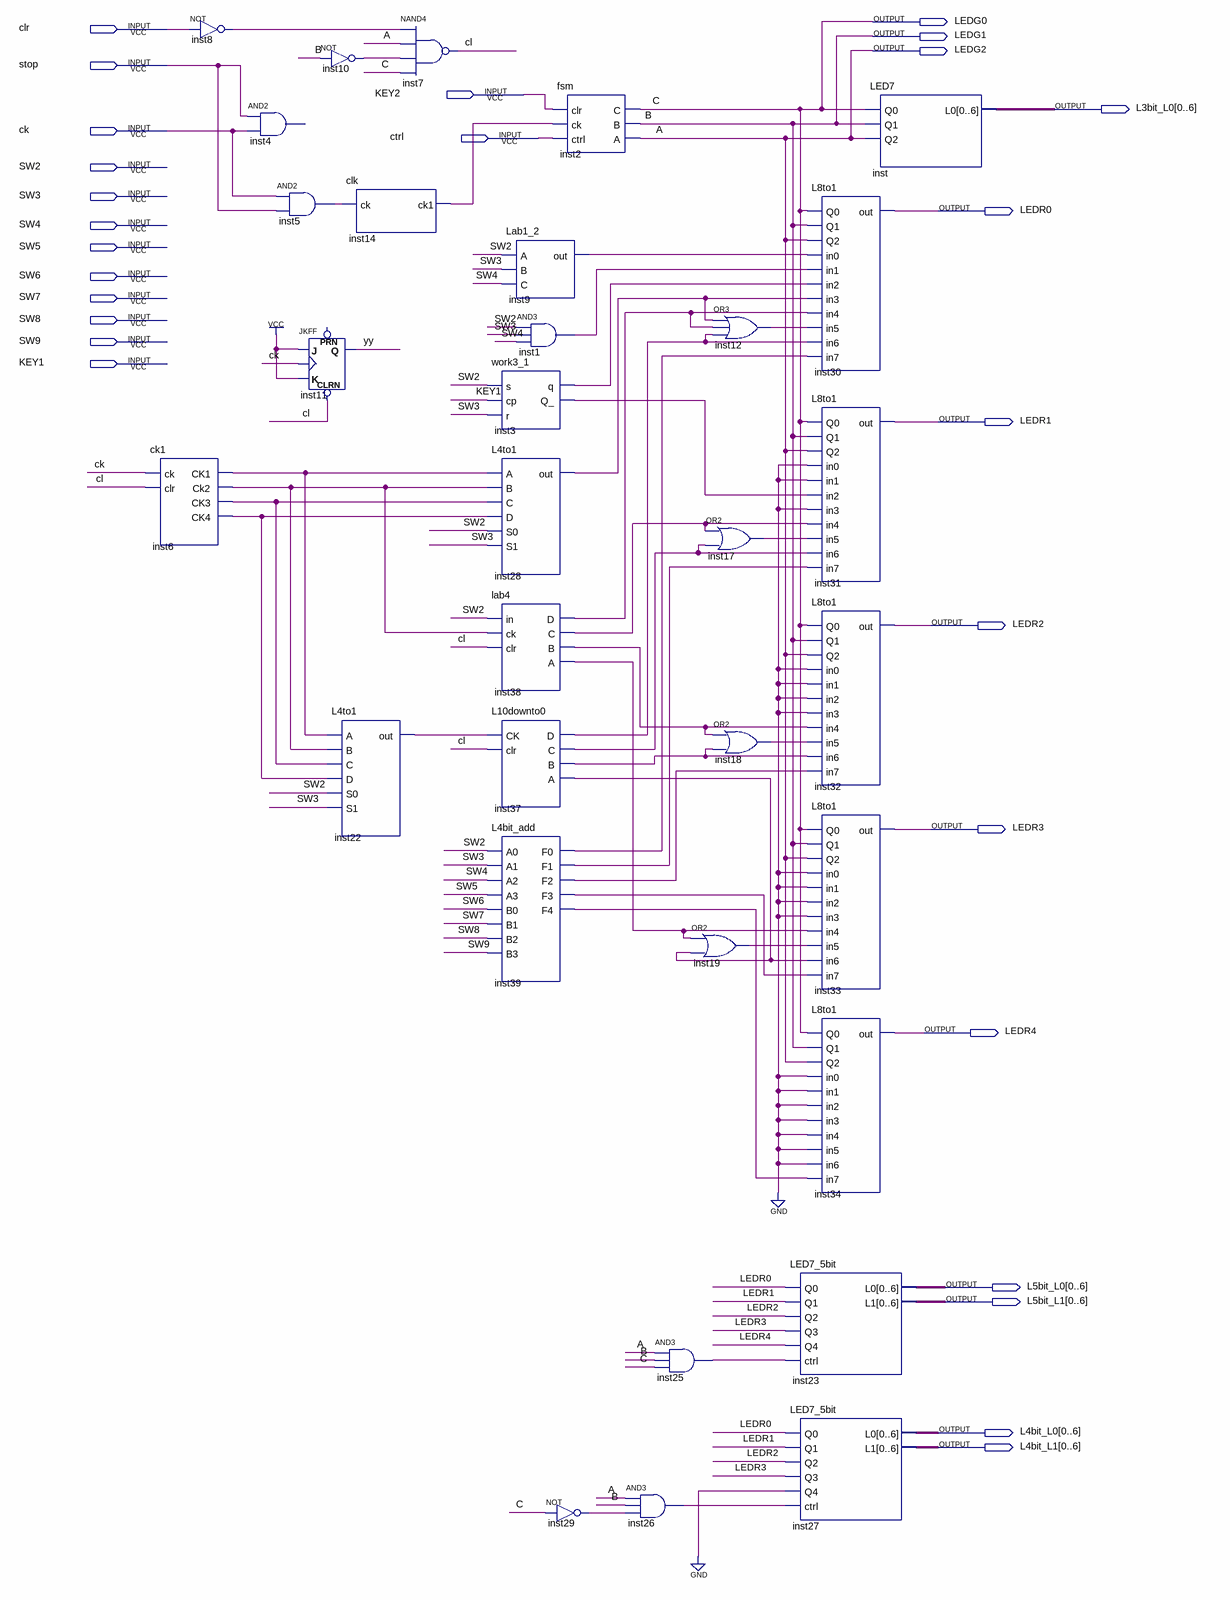
[diagram p0: schematic sheet]
// Quartus schematic final_project.bdf as structural Verilog: 32 symbols, 27 pins
module final_project (
  input  clr,
  input  stop,
  input  KEY2,
  input  ck,
  input  ctrl,
  input  SW2,
  input  SW3,
  input  SW4,
  input  SW5,
  input  SW6,
  input  SW7,
  input  SW8,
  input  SW9,
  input  KEY1,
  output LEDG0,
  output LEDG1,
  output LEDG2,
  output [0:6] L3bit_L0,
  output LEDR0,
  output LEDR1,
  output LEDR2,
  output LEDR3,
  output LEDR4,
  output [0:6] L5bit_L0,
  output [0:6] L5bit_L1,
  output [0:6] L4bit_L0,
  output [0:6] L4bit_L1
);

  wire cl, inst1_out, inst3_q, inst3_q_, inst5_out, inst6_ck1, inst6_ck2, inst6_ck3, inst6_ck4, inst8_out,
       inst9_out, inst10_out, inst12_out, inst14_ck1, inst17_out, inst18_out, inst19_out, inst22_out,
       inst25_out, inst26_out, inst28_out, inst29_out, inst37_a, inst37_b, inst37_c, inst37_d, inst38_a,
       inst38_b, inst38_c, inst38_d, inst39_f0, inst39_f1, inst39_f2, inst39_f3, inst39_f4, yy;

  ck1 inst6 (.ck(ck), .clr(cl), .CK1(inst6_ck1), .Ck2(inst6_ck2), .CK3(inst6_ck3), .CK4(inst6_ck4));
  not inst8 (inst8_out, clr);
  // AND2 inst4 has open pins: IN1=stop, IN2=ck, OUT=open
  and inst5 (inst5_out, ck, stop);
  not inst10 (inst10_out, LEDG1);
  clk inst14 (.ck(inst5_out), .ck1(inst14_ck1));
  JKFF inst11 (.CLRN(cl), .K(1'b1), .J(1'b1), .CLK(ck), .Q(yy));  // open: PRN
  L4to1 inst22 (.A(inst6_ck1), .B(inst6_ck2), .C(inst6_ck3), .D(inst6_ck4), .S0(SW2), .S1(SW3), .out(inst22_out));
  nand inst7 (cl, inst8_out, LEDG2, inst10_out, LEDG0);
  Lab1_2 inst9 (.A(SW2), .B(SW3), .C(SW4), .out(inst9_out));
  and inst1 (inst1_out, SW2, SW3, SW4);
  work3_1 inst3 (.s(SW2), .cp(KEY1), .r(SW3), .q(inst3_q), .Q_(inst3_q_));
  L4to1 inst28 (.A(inst6_ck1), .B(inst6_ck2), .C(inst6_ck3), .D(inst6_ck4), .S0(SW2), .S1(SW3), .out(inst28_out));
  lab4 inst38 (.in(SW2), .ck(inst6_ck2), .clr(cl), .D(inst38_d), .C(inst38_c), .B(inst38_b), .A(inst38_a));
  L10downto0 inst37 (.CK(inst22_out), .clr(cl), .D(inst37_d), .C(inst37_c), .B(inst37_b), .A(inst37_a));
  L4bit_add inst39 (
    .A0(SW2), .B3(SW9), .A1(SW3), .A2(SW4), .A3(SW5), .B0(SW6), .B1(SW7), .B2(SW8), .F0(inst39_f0),
    .F1(inst39_f1), .F2(inst39_f2), .F3(inst39_f3), .F4(inst39_f4));
  fsm inst2 (.clr(KEY2), .ck(inst14_ck1), .ctrl(ctrl), .C(LEDG0), .B(LEDG1), .A(LEDG2));
  not inst29 (inst29_out, LEDG0);
  and inst26 (inst26_out, LEDG2, LEDG1, inst29_out);
  or inst19 (inst19_out, inst38_a, inst37_a);
  and inst25 (inst25_out, LEDG2, LEDG1, LEDG0);
  or inst12 (inst12_out, inst28_out, inst38_d, inst37_d);
  or inst17 (inst17_out, inst38_c, inst37_c);
  or inst18 (inst18_out, inst38_b, inst37_b);
  L8to1 inst30 (
    .Q0(LEDG0), .Q1(LEDG1), .Q2(LEDG2), .in0(inst9_out), .in1(inst1_out), .in2(inst3_q), .in3(inst28_out),
    .in4(inst38_d), .in5(inst12_out), .in6(inst37_d), .in7(inst39_f0), .out(LEDR0));
  L8to1 inst31 (
    .Q0(LEDG0), .Q1(LEDG1), .Q2(LEDG2), .in0(1'b0), .in1(1'b0), .in2(inst3_q_), .in3(1'b0), .in4(inst38_c),
    .in5(inst17_out), .in6(inst37_c), .in7(inst39_f1), .out(LEDR1));
  L8to1 inst32 (
    .Q0(LEDG0), .Q1(LEDG1), .Q2(LEDG2), .in0(1'b0), .in1(1'b0), .in2(1'b0), .in3(1'b0), .in4(inst38_b),
    .in5(inst18_out), .in6(inst37_b), .in7(inst39_f2), .out(LEDR2));
  L8to1 inst33 (
    .Q0(LEDG0), .Q1(LEDG1), .Q2(LEDG2), .in0(1'b0), .in1(1'b0), .in2(1'b0), .in3(1'b0), .in4(inst38_a),
    .in5(inst19_out), .in6(inst37_a), .in7(inst39_f3), .out(LEDR3));
  L8to1 inst34 (
    .Q0(LEDG0), .Q1(LEDG1), .Q2(LEDG2), .in0(1'b0), .in1(1'b0), .in2(1'b0), .in3(1'b0), .in4(1'b0),
    .in5(1'b0), .in6(1'b0), .in7(inst39_f4), .out(LEDR4));
  LED7_5bit inst23 (
    .Q0(LEDR0), .Q1(LEDR1), .Q2(LEDR2), .Q3(LEDR3), .Q4(LEDR4), .ctrl(inst25_out), .L0(L5bit_L0),
    .L1(L5bit_L1));
  LED7_5bit inst27 (
    .Q0(LEDR0), .Q1(LEDR1), .Q2(LEDR2), .Q3(LEDR3), .Q4(1'b0), .ctrl(inst26_out), .L0(L4bit_L0), .L1(L4bit_L1));
  LED7 inst (.Q0(LEDG0), .Q1(LEDG1), .Q2(LEDG2), .L0(L3bit_L0));

  // Other names for the same wires on the sheet: C = LEDG0; B = LEDG1; A = LEDG2
endmodule
